# Altium schematic sheet 智能家居-温湿度传感器.SchDoc
size A4
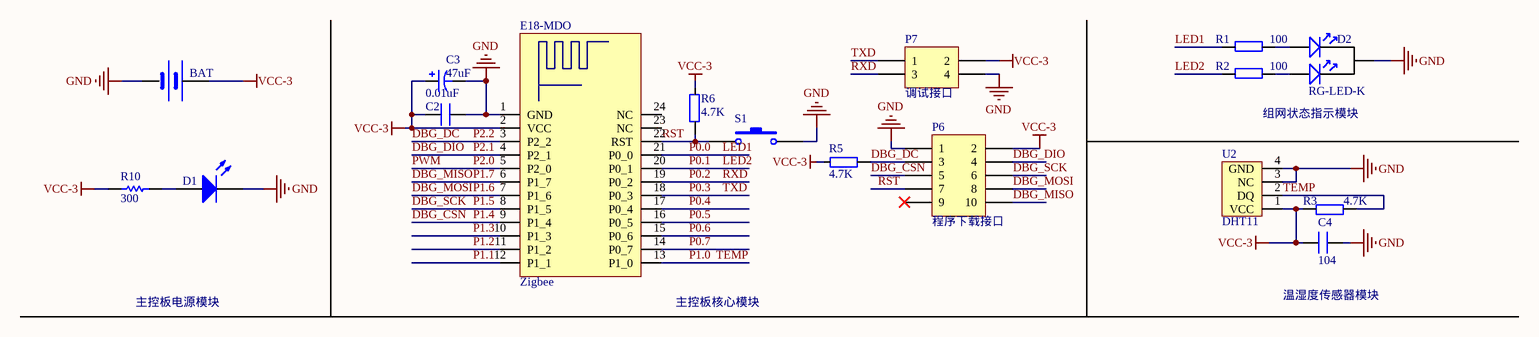
[diagram p0: 智能家居-温湿度传感器.SchDoc]

## Parts
BAT  BATT  [BATM]  (value not drawn)
C2  0.01uF  [0.1UF]
C3  value 47uF  [CD5]  (hidden comment: Cap Pol1)
C4  104  [0.1UF]
D1  LED0  [LED-3]  (value not drawn)
D2  RG-LED-K  [RG-LED]
E18-MDO  Zigbee  [E18-MD0-1]
P6  程序下载接口  [HDR2X5]
P7  调试接口  [HDR2X2]
R1  100  [AXIAL-0.3]
R2  100  [AXIAL-0.3]
R3  4.7K  [AXIAL-0.3]
R5  4.7K  [AXIAL-0.3]
R6  4.7K  [AXIAL-0.3]
R10  value 300  [AXIAL-0.3]  (hidden comment: Res1)
S1  SW-PB  [KEY_M]  (value not drawn)
U2  DHT11  [HDR1X4]

## Nets
GND: BAT.2(GND) C2.2 C3.2 C4.1 D1.2(K) D2.2(GND) E18-MDO.1(GND) P6.1 P7.4 S1.2 U2.3(NC) U2.4(GND)
VCC-3: BAT.1(VCC) C2.1 C3.1 C4.2 E18-MDO.2(VCC) P6.2 P7.2 R3.1 R5.1 R6.1 R10.1 U2.1(VCC)
DBG_CSN: E18-MDO.9(P1_4) P6.5  [also labelled P1.4]
DBG_DC: E18-MDO.3(P2_2) P6.3 R5.2  [also labelled P2.2]
DBG_DIO: E18-MDO.4(P2_1) P6.4  [also labelled P2.1]
DBG_MISO: E18-MDO.6(P1_7) P6.10  [also labelled P1.7]
DBG_MOSI: E18-MDO.7(P1_6) P6.8  [also labelled P1.6]
DBG_SCK: E18-MDO.8(P1_5) P6.6  [also labelled P1.5]
LED1: E18-MDO.21(P0_0) R1.2  [also labelled P0.0]
LED2: E18-MDO.20(P0_1) R2.2  [also labelled P0.1]
P0.2: E18-MDO.19(P0_2) P7.3  [also labelled RXD]
P0.3: E18-MDO.18(P0_3) P7.1  [also labelled TXD]
P0.4: E18-MDO.17(P0_4)
P0.5: E18-MDO.16(P0_5)
P0.6: E18-MDO.15(P0_6)
P0.7: E18-MDO.14(P0_7)
P1.0: E18-MDO.13(P1_0) R3.2 U2.2(DQ)  [also labelled TEMP]
P1.1: E18-MDO.12(P1_1)
P1.2: E18-MDO.11(P1_2)
P1.3: E18-MDO.10(P1_3)
P2.0: E18-MDO.5(P2_0)  [also labelled PWM]
RST: E18-MDO.22(RST) P6.7 R6.2 S1.1
NetD1_1: D1.1(A) R10.2
NetD2_1: D2.1(R) R1.1
NetD2_3: D2.3(G) R2.1

Not connected (* = marked no-connect by the designer): E18-MDO 23(NC) 24(NC); P6 9*

## Notes on the sheet
- 组网状态指示模块
- (near C4) 温湿度传感器模块
- 主控板电源模块
- (near E18-MDO) 主控板核心模块

## Library data of the parts
BAT = BAT
C2 C4 = C
C3 = Cap Pol1: Polarized Capacitor (Radial); Published: 8-Jun-2000; LatestRevisionDate: 17-Jul-2002; LatestRevisionNote: Re-released for DXP Platform.; PackageReference: RB7.6-15; Publisher: Altium Limited; PackageDescription: Polarized Capacitor (Radial); 2 Leads
D1 = LED0: Typical INFRARED GaAs LED; Published: 8-Jun-2000; LatestRevisionDate: 08-Jul-2005; LatestRevisionNote: Mech Layer 1 removed.; PackageReference: LED-0; Publisher: Altium Limited; PackageDescription: LED; 2 Leads
E18-MDO = E18-MDO: Zigbee模块
P6 = Header 5X2: Header, 5-Pin, Dual row; LatestRevisionDate: 17-Jul-2002; LatestRevisionNote: Re-released for DXP Platform.; Publisher: Altium Limited
P7 = Header 2X2H: Header, 2-Pin, Dual row, Right Angle; LatestRevisionDate: 17-Jul-2002; LatestRevisionNote: Re-released for DXP Platform.; Publisher: Altium Limited
R1-R3 R5 R6 = R
R10 = Res1: Resistor; Published: 8-Jun-2000; LatestRevisionDate: 17-Jul-2002; LatestRevisionNote: Re-released for DXP Platform.; PackageReference: AXIAL-0.3; Publisher: Altium Limited; PackageDescription: Axial Device, Thru-Hole; 2 Leads; 0.3 in Pin Spacing
S1 = SW-PB: Switch; Published: 24-Mar-1999; LatestRevisionDate: 17-Jul-2002; LatestRevisionNote: Re-released for DXP Platform.; PackageReference: SPST-2; Publisher: Altium Limited; PackageDescription: Switch; 2 Leads
U2 = DHT11: 数字温湿度传感器